# EAGLE design control_bdr (EAGLE 9.6.2)
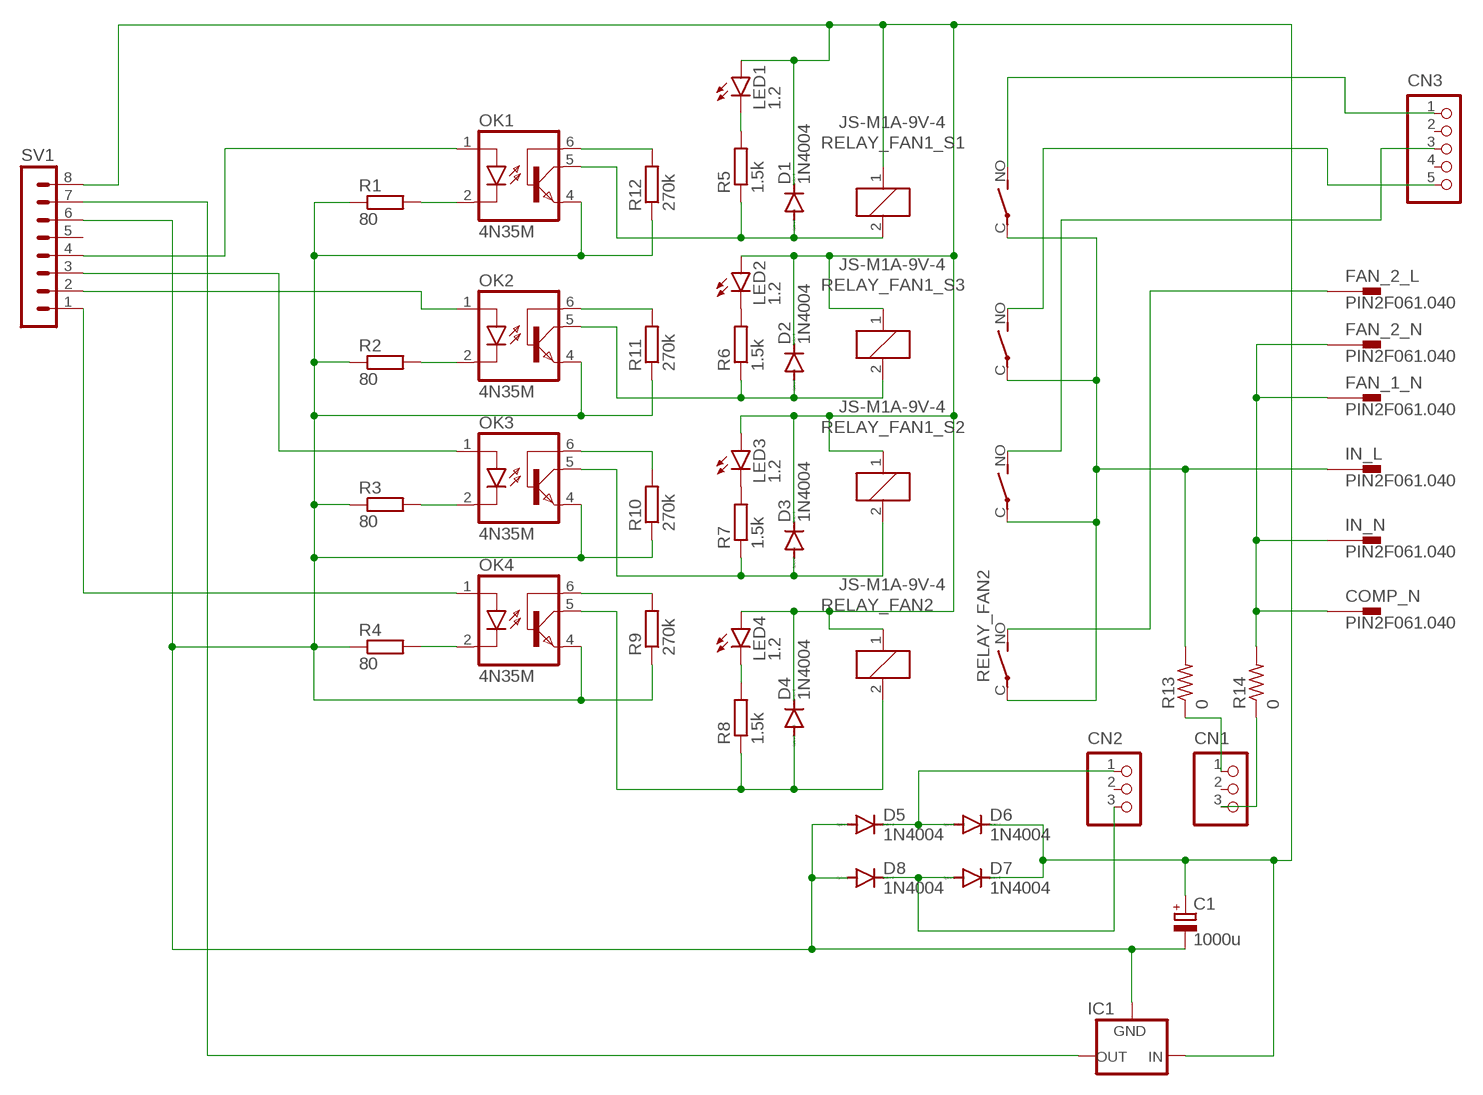
[diagram p0: schematic, sheet 1]

## Parts
C1  1000u  CPOL-EUE3.5-10  [E3,5-10]
CN1  B3P-VH  [B3P-VH]
CN2  B3B-XASK-1  [B3B-XASK-1]
CN3  B5P-VH  [B5P-VH]
COMP_N  PIN2F061.040  [F061.040]
D1  1N4004  [DO41-10]
D2  1N4004  [DO41-10]
D3  1N4004  [DO41-10]
D4  1N4004  [DO41-10]
D5  1N4004  [DO41-10]
D6  1N4004  [DO41-10]
D7  1N4004  [DO41-10]
D8  1N4004  [DO41-10]
FAN_1_N  PIN2F061.040  [F061.040]
FAN_2_L  PIN2F061.040  [F061.040]
FAN_2_N  PIN2F061.040  [F061.040]
IC1  78XXL  [78XXL]
IN_L  PIN2F061.040  [F061.040]
IN_N  PIN2F061.040  [F061.040]
LED1  1.2  LED5MM  [LED5MM]
LED2  1.2  LED5MM  [LED5MM]
LED3  1.2  LED5MM  [LED5MM]
LED4  1.2  LED5MM  [LED5MM]
OK1  4N35M  [DIL06]
OK2  4N35M  [DIL06]
OK3  4N35M  [DIL06]
OK4  4N35M  [DIL06]
R1  80  R-EU_0204/7  [0204/7]
R2  80  R-EU_0204/7  [0204/7]
R3  80  R-EU_0204/7  [0204/7]
R4  80  R-EU_0204/7  [0204/7]
R5  1.5k  R-EU_0204/7  [0204/7]
R6  1.5k  R-EU_0204/7  [0204/7]
R7  1.5k  R-EU_0204/7  [0204/7]
R8  1.5k  R-EU_0204/7  [0204/7]
R9  270k  R-EU_0204/7  [0204/7]
R10  270k  R-EU_0204/7  [0204/7]
R11  270k  R-EU_0204/7  [0204/7]
R12  270k  R-EU_0204/7  [0204/7]
R13  0  R-US_0204/2V  [0204V]
R14  0  R-US_0204/2V  [0204V]
RELAY_FAN1_S1  JS-M1A-9V-4  [JS-M1A]
RELAY_FAN1_S2  JS-M1A-9V-4  [JS-M1A]
RELAY_FAN1_S3  JS-M1A-9V-4  [JS-M1A]
RELAY_FAN2  JS-M1A-9V-4  [JS-M1A]
SV1  MA08-1  [MA08-1]

## Nets
N$1 [AC_IN_HIGH]: IN_L.A1 IN_L.A2 R13.2 RELAY_FAN1_S1.C(2:P) RELAY_FAN1_S2.C(2:P) RELAY_FAN1_S3.C(2:P) RELAY_FAN2.C(2:P)
N$2 [FAN_1_IN]: CN3.1 RELAY_FAN1_S1.NO(2:S)
N$3 [FAN_1_IN]: CN3.5 RELAY_FAN1_S3.NO(2:S)
N$4 [FAN_1_IN]: CN3.3 RELAY_FAN1_S2.NO(2:S)
N$5 [FAN_2_IN]: FAN_2_L.A1 FAN_2_L.A2 RELAY_FAN2.NO(2:S)
N$6 [AC_IN_HIGH]: COMP_N.A1 COMP_N.A2 FAN_1_N.A1 FAN_1_N.A2 FAN_2_N.A1 FAN_2_N.A2 IN_N.A1 IN_N.A2 R14.2
N$7 [dc_v]: OK1.2(C) R1.2
N$8 [dc_v]: OK2.2(C) R2.2
N$9 [dc_v]: OK3.2(C) R3.2
N$10 [dc_v]: OK4.2(C) R4.2
N$11 [gnd]: C1.- D5.A D8.A IC1.GND OK1.4(EMI) OK2.4(EMI) OK3.4(EMI) OK4.4(EMI) R1.1 R2.1 R3.1 R4.1 R9.1 R10.1 R11.1 R12.1 SV1.6
N$12 [dc_v]: LED2.K(C) R6.2
N$13 [dc_v]: LED1.K(C) R5.2
N$14 [dc_v]: LED3.K(C) R7.2
N$15 [dc_v]: LED4.K(C) R8.2
N$16 [AC_IN_LOW_CURR]: CN1.1 R13.1
N$17 [AC_IN_LOW_CURR]: CN1.3 R14.1
N$18 [dc_v]: OK4.6(BAS) R9.2
N$19 [dc_v]: OK3.6(BAS) R10.2
N$20 [dc_v]: OK2.6(BAS) R11.2
N$21 [dc_v]: OK1.6(BAS) R12.2
N$22 [dc_12v]: CN2.1 D5.C D6.A
N$23 [dc_v]: IC1.OUT SV1.7
N$24 [dc_12v]: CN2.3 D7.A D8.C
N$25 [dc_v]: OK2.1(A) SV1.2
N$26 [dc_v]: D4.A OK4.5(COL) R8.1 RELAY_FAN2.2
N$27 [dc_v]: D3.A OK3.5(COL) R7.1 RELAY_FAN1_S2.2
N$28 [dc_v]: D2.A OK2.5(COL) R6.1 RELAY_FAN1_S3.2
N$29 [dc_v]: D1.A OK1.5(COL) R5.1 RELAY_FAN1_S1.2
N$30 [dc_v]: OK1.1(A) SV1.4
N$32 [dc_v]: OK3.1(A) SV1.3
N$33 [dc_v]: OK4.1(A) SV1.1
N$34 [dc_12v]: C1.+ D1.C D2.C D3.C D4.C D6.C D7.C IC1.IN LED1.A LED2.A LED3.A LED4.A RELAY_FAN1_S1.1 RELAY_FAN1_S2.1 RELAY_FAN1_S3.1 RELAY_FAN2.1 SV1.8
Unconnected: CN1.2 CN2.2 CN3.2 CN3.4 SV1.5

## Library data of the parts
C1 = rcl:CPOL-EU: POLARIZED CAPACITOR, European symbol; SPICEPREFIX: C
CN1 = jst-vh:B3P-VH: Wire-to-Board 3.96mm pitch top mount connector Source: http://www.jst-mfg.com/product/pdf/jpn/VH.pdf http://www.jst-mfg.com/product/detail.php?series=262
CN2 = jst-xa:B3B-XASK-1: Wire-to-Board 2.5mm pitch top mount connector Source: http://www.jst-mfg.com/product/pdf/jpn/XA1.pdf http://www.jst-mfg.com/product/detail.php?series=272
CN3 = jst-vh:B5P-VH: Wire-to-Board 3.96mm pitch top mount connector Source: http://www.jst-mfg.com/product/pdf/jpn/VH.pdf http://www.jst-mfg.com/product/detail.php?series=262
COMP_N FAN_1_N FAN_2_L FAN_2_N IN_L IN_N = con-faston:PIN2: Flachstecker Typ Tyco/Electronics/AMP TAB, FASTON Printed Circuit Board Tabs Source: http://www.buerklin.com, http://catalog.tycoelectronics.com; OC_FARNELL: unknown; OC_NEWARK: unknown
D1-D8 = diode:1N4004: DIODE general purpose rectifier, 1 A
IC1 = v-reg:78XXL: VOLTAGE REGULATOR
LED1-LED4 = led:LED: LED OSRAM: - CHIPLED LG R971, LG N971, LY N971, LG Q971, LY Q971, LO R971, LY R971 LH N974, LH R974 LS Q976, LO Q976, LY Q976 LO Q996 - Hyper CHIPLED LW Q18S LB Q993, LB Q99A, LB R99A - SideLED LS A670, LO A670, LY A670, LG A670, LP A670 LB A673, LV A673, LT A673, LW A673 LH A674 LY A675 LS A676, LA A676, LO A676, LY A676, LW A676 LS A679, LY A679, LG A679 - Hyper Micro SIDELED® LS Y876, LA Y876, LO Y876, LY Y876 LT Y87S - SmartLED LW L88C, LW L88S LB L89C, LB L89S, LG L890 LS L89K, LO L89K, LY L89K LS L896, LA L896, LO L896, LY L896 - TOPLED LS T670, LO T670, LY T670, LG T670, LP T670 LSG T670, LSP T670, LSY T670, LOP T670, LYG T670 LG T671, LOG T671, LSG T671 LB T673, LV T673, LT T673, LW T673 LH T674 LS T676, LA T676, LO T676, LY T676, LB T676, LH T676, LSB T676, LW T676 LB T67C, LV T67C, LT T67C, LS T67K, LO T67K, LY T67K, LW E67C LS E67B, LA E67B, LO E67B, LY E67B, LB E67C, LV E67C, LT E67C LW T67C LS T679, LY T679, LG T679 LS T770, LO T770, LY T770, LG T770, LP T770 LB T773, LV T773, LT T773, LW T773 LH T774 LS E675, LA E675, LY E675, LS T675 LS T776, LA T776, LO T776, LY T776, LB T776 LHGB T686 LT T68C, LB T68C - Hyper Mini TOPLED® LB M676 - Mini TOPLED Santana® LG M470 LS M47K, LO M47K, LY M47K Source: http://www.osram.convergy.de LUXEON: - LUMILED® LXK2-PW12-R00, LXK2-PW12-S00, LXK2-PW14-U00, LXK2-PW14-V00 LXK2-PM12-R00, LXK2-PM12-S00, LXK2-PM14-U00 LXK2-PE12-Q00, LXK2-PE12-R00, LXK2-PE12-S00, LXK2-PE14-T00, LXK2-PE14-U00 LXK2-PB12-K00, LXK2-PB12-L00, LXK2-PB12-M00, LXK2-PB14-N00, LXK2-PB14-P00, LXK2-PB14-Q00 LXK2-PR12-L00, LXK2-PR12-M00, LXK2-PR14-Q00, LXK2-PR14-R00 LXK2-PD12-Q00, LXK2-PD12-R00, LXK2-PD12-S00 LXK2-PH12-R00, LXK2-PH12-S00 LXK2-PL12-P00, LXK2-PL12-Q00, LXK2-PL12-R00 Source: www.luxeon.com KINGBRIGHT: KA-3528ASYC Source: www.kingbright.com
OK1-OK4 = optocoupler:4N*?M: General Purpose 6-Pin Phototransistor Optocouplers Source: http://www.fairchildsemi.com/ds/4N/4N35-M.pdf; MPN: 4N35-M; OC_FARNELL: 1021351; OC_NEWARK: 98K9114
R1-R12 = rcl:R-EU_: RESISTOR, European symbol; SPICEPREFIX: R
R13 R14 = rcl:R-US_: RESISTOR, American symbol; SPICEPREFIX: R
RELAY_FAN1_S1-RELAY_FAN1_S3 RELAY_FAN2 = relay:JS-M1A*: Automotive Ultra-Miniature Power Relay NAiS Source: http://www.mew-europe.com/.. en_ds_61211_0000.pdf; OC_FARNELL: unknown; OC_NEWARK: unknown
SV1 = con-lstb:MA08-1: PIN HEADER; OC_FARNELL: unknown; OC_NEWARK: unknown

## Net classes
1 AC_IN_HIGH: width 10.16 mm, clearance 0.61 mm
2 FAN_1_IN: width 3.81 mm, clearance 0.61 mm
3 FAN_2_IN: width 5.08 mm, clearance 0.61 mm
4 AC_IN_LOW: width 7.62 mm, clearance 0.61 mm
5 dc_v: width 0.406 mm, clearance 0.051 mm
6 dc_12v: width 0.406 mm, clearance 0.051 mm
7 AC_IN_LOW_CURR: width 0.813 mm, clearance 0.61 mm
8 gnd: width 0.406 mm, clearance 0.051 mm

## Board
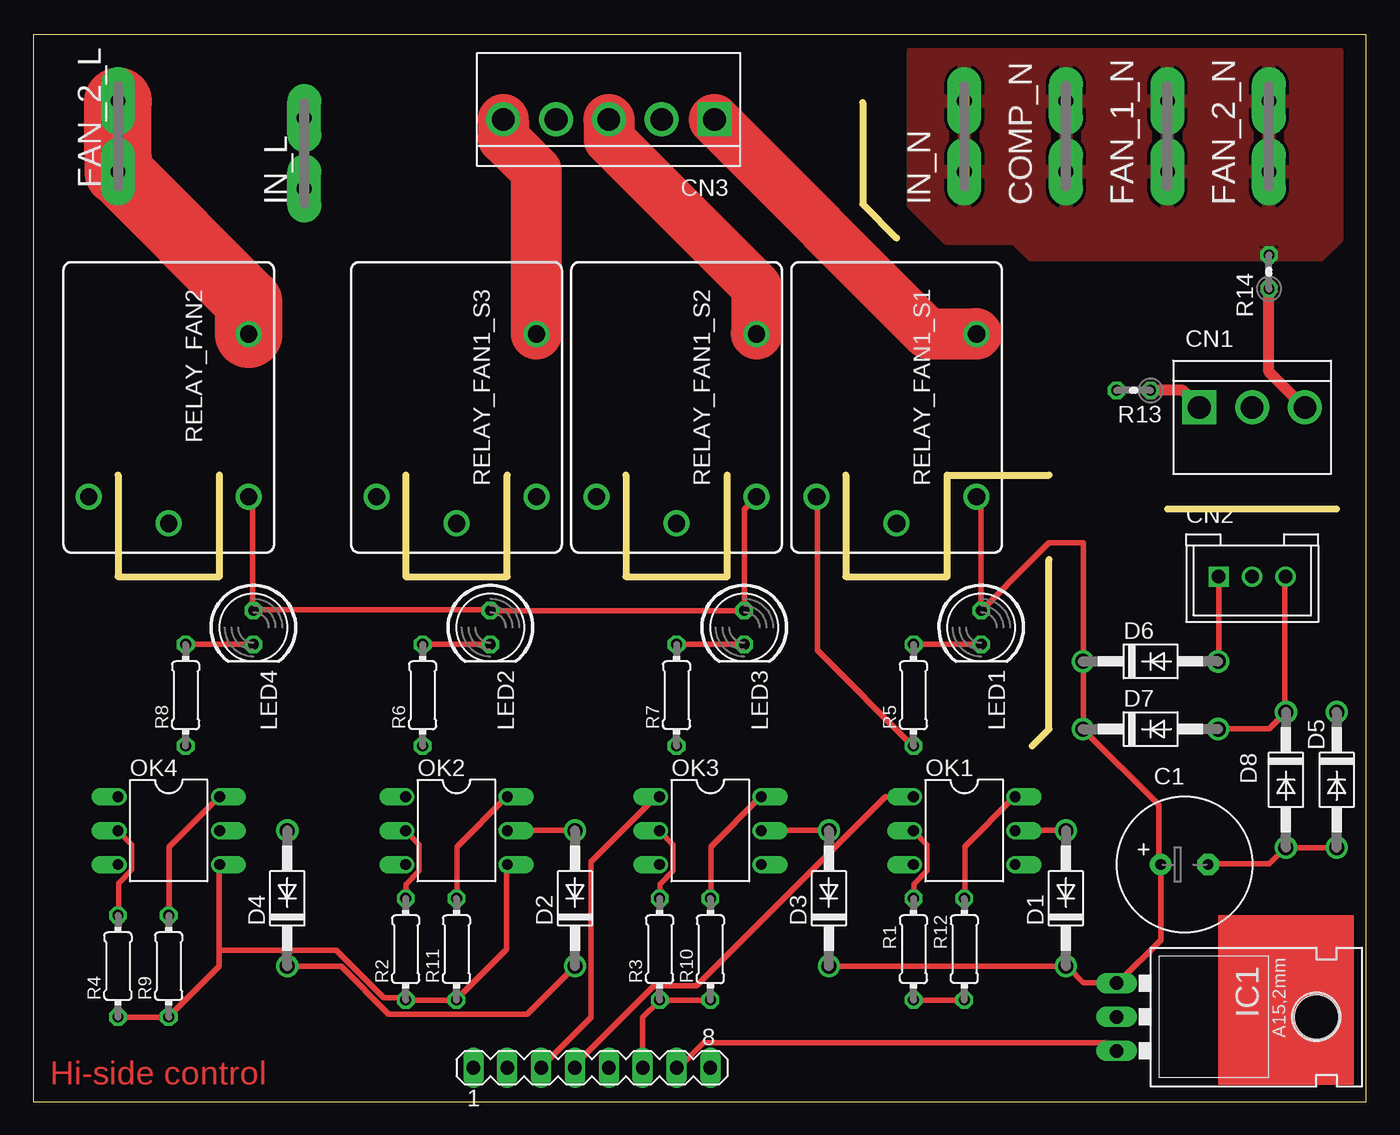
[diagram p1: board, top side]
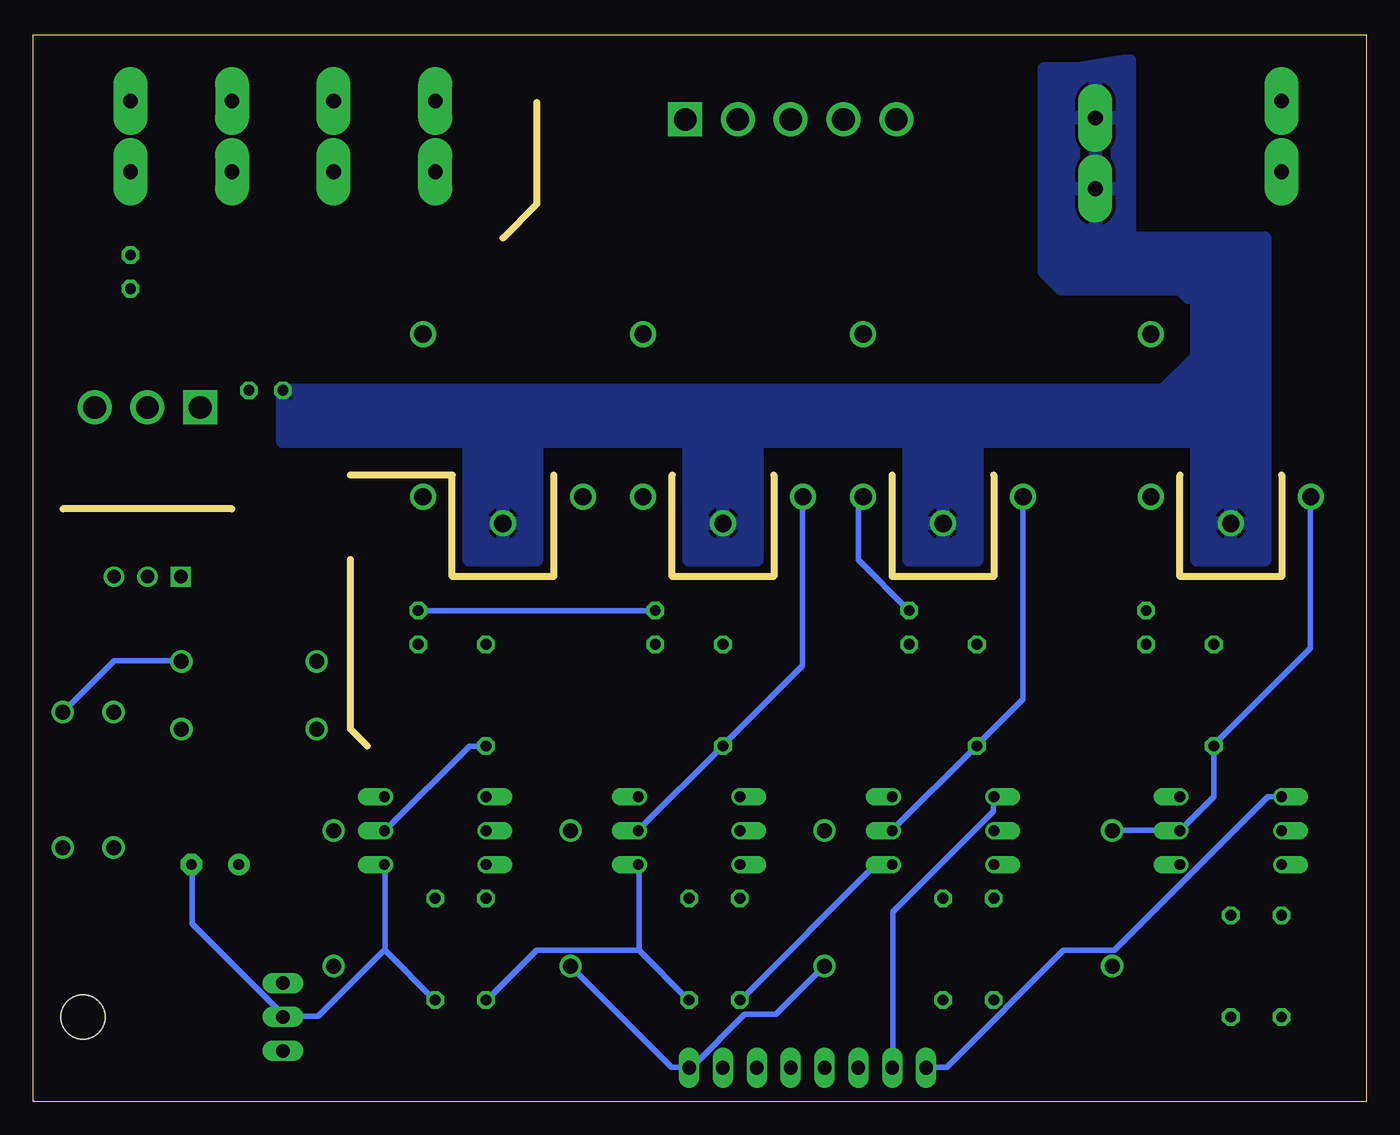
[diagram p2: board, bottom side, seen from below]

Size 100 x 80 mm. Coordinates in mm from the lower left corner, seen from the top.
Outline: 0,0 100,0 100,80 0,80 0,0
Copper layers (1*16): Top 0.035mm / dielectric 1.5mm / Bottom 0.035mm
Design rules "default": minimum track width 6mil, minimum drill 0.35mm, track to track 6mil, track to pad 6mil, pad to pad 6mil, via to via 6mil, smd to smd 6mil, copper to edge 40mil, drill to drill 6mil, minimum pad ring 10mil, minimum via ring 8mil, stop-mask expansion 4mil, vias tented up to drill 0mil, thermal gap 10mil
tRestrict: 18 lines
Milling: 18 lines

### Footprints (pad centres in the part's own frame; a part is rotated, then mirrored left to right if it is on the bottom)
E3,5-10 = drill 0.813 pad 1.6: + -1.778,0 | drill 0.813 pad 1.6 octagon: - 1.778,0
B3P-VH = drill 1.7 square: 1 -3.96,0 | drill 1.7: 2 0,0; 3 3.96,0
B3B-XASK-1 = drill 1.016 square: 1 -2.5,0 | drill 1.016: 2 0,0; 3 2.5,0
B5P-VH = drill 1.7 square: 1 -7.92,0 | drill 1.7: 2 -3.96,0; 3 0,0; 4 3.96,0; 5 7.92,0
F061.040 = drill 1.1 pad 2.54 long: A1 -2.65,0; A2 2.65,0
DO41-10 = drill 1.118: A 5.08,0; C -5.08,0
78XXL = drill 1.016 long: GND 0,-3.81; IN -2.54,-3.81; OUT 2.54,-3.81 | hole 3.302: 0,11.176
LED5MM = drill 0.813 octagon: A -1.27,0; K 1.27,0
DIL06 = drill 0.813 offset: 1 -2.54,-3.81; 2 0,-3.81; 3 2.54,-3.81; 4 2.54,3.81; 5 0,3.81; 6 -2.54,3.81
0204/7 = drill 0.813 octagon: 1 -3.81,0; 2 3.81,0
0204V = drill 0.813 octagon: 1 -1.27,0; 2 1.27,0
JS-M1A = drill 1.3: 1 6.7,6; 2 6.7,-6; C 8.7,0; NO -5.5,6
MA08-1 = drill 1.016 long: 1 -8.89,0; 2 -6.35,0; 3 -3.81,0; 4 -1.27,0; 5 1.27,0; 6 3.81,0; 7 6.35,0; 8 8.89,0

### Placement (x,y rotation side)
C1  86.36,17.78 0 top
CN1  91.44,52.07 0 top
CN2  91.44,39.37 0 top
CN3  43.18,73.66 180 top
COMP_N  77.47,72.39 90 top
D1  77.47,15.24 90 top
D2  40.64,15.24 90 top
D3  59.69,15.24 90 top
D4  19.05,15.24 90 top
D5  97.79,24.13 270 top
D6  83.82,33.02 0 top
D7  83.82,27.94 0 top
D8  93.98,24.13 270 top
FAN_1_N  85.09,72.39 270 top
FAN_2_L  6.35,72.39 90 top
FAN_2_N  92.71,72.39 90 top
IC1  85.09,6.35 270 top
IN_L  20.32,71.12 90 top
IN_N  69.85,72.39 90 top
LED1  71.12,35.56 270 top
LED2  34.29,35.56 270 top
LED3  53.34,35.56 270 top
LED4  16.51,35.56 270 top
OK1  69.85,20.32 270 top
OK2  31.75,20.32 270 top
OK3  50.8,20.32 270 top
OK4  10.16,20.32 270 top
R1  66.04,11.43 90 top
R2  27.94,11.43 90 top
R3  46.99,11.43 90 top
R4  6.35,10.16 90 top
R5  66.04,30.48 90 top
R6  29.21,30.48 90 top
R7  48.26,30.48 90 top
R8  11.43,30.48 90 top
R9  10.16,10.16 90 top
R10  50.8,11.43 90 top
R11  31.75,11.43 90 top
R12  69.85,11.43 90 top
R13  82.55,53.34 180 top
R14  92.71,62.23 90 top
RELAY_FAN1_S1  64.77,52.07 270 top
RELAY_FAN1_S2  48.26,52.07 270 top
RELAY_FAN1_S3  31.75,52.07 270 top
RELAY_FAN2  10.16,52.07 270 top
SV1  41.91,2.54 0 top

### Tracks (layer width: path | path; a pad name or v marks a point on that pad's centre or on a via)
N$1
  pour Bottom: 17.78,78.11 17.78,64.77 7.62,64.77 7.62,40.64 12.7,40.64 12.7,49.53 29.21,49.53 29.21,40.64 34.29,40.64 34.29,49.53 45.72,49.53 45.72,40.64 50.8,40.64 50.8,49.53 62.23,49.53 62.23,40.64 67.31,40.64 67.31,49.53 81.28,49.53 81.28,53.34 15.24,53.34 12.7,55.88 12.7,60.33 13.34,60.33 13.97,60.96 22.86,60.96 24.13,62.23 24.13,77.47 21.59,77.47
N$2
  Top 3.81: RELAY_FAN1_S1.NO 70.71,57.61 67.13,57.61 51.13,73.61 CN3.1
N$3
  Top 3.81: RELAY_FAN1_S3.NO 37.72,57.61 37.72,69.8 35.28,72.24 35.28,73.61 CN3.5
N$4
  Top 3.81: RELAY_FAN1_S2.NO 54.25,57.61 54.25,61.11 43.2,72.16 43.2,73.61 CN3.3
N$5
  Top 5.08: RELAY_FAN2.NO 16.15,57.61 16.15,59.97 6.4,69.72 FAN_2_L.A1 6.33,72.24 6.33,74.98 FAN_2_L.A2
N$6
  pour Top: 66.04,78.74 66.04,67.31 68.58,64.77 73.66,64.77 74.93,63.5 96.52,63.5 97.79,64.77 97.79,78.74
N$7
  Top 0.406: R1.2 66.06,15.24 66.06,16.31 67.06,17.3 67.06,19.28 66.06,20.27 OK1.2
N$8
  Top 0.406: R2.2 27.96,15.24 27.96,16.31 28.96,17.3 28.96,19.28 27.96,20.27 OK2.2
N$9
  Top 0.406: R3.2 47.02,15.24 47.02,16.31 48.01,17.3 48.01,19.28 47.02,20.27 OK3.2
N$10
  Top 0.406: OK4.2 7.39,19.28 7.39,17.37 6.4,16.38 6.4,14.02 R4.2
N$11
  Top 0.406: OK2.4 35.51,17.75 35.51,11.43 31.85,7.77 R11.1 R2.1 27.81,7.77 26.29,7.77 22.71,11.35 13.95,11.35 | R4.1 6.4,6.33 10.13,6.33 R9.1 13.95,10.13 13.95,11.35 | 13.95,11.35 13.95,17.75 OK4.4 | R10.1 R3.1 46.86,7.47 45.72,6.33 SV1.6 | R12.1 R1.1 | C1.- 88.16,17.83 92.73,17.83 93.95,19.05 D8.A D5.A
  Bottom 0.406: 54.56,11.35 54.56,17.75 OK3.4 | 54.56,11.35 50.83,7.62 R10.1 | 73.61,11.35 73.61,17.75 OK1.4 | 73.61,11.35 69.88,7.62 R12.1 | 54.56,11.35 62.26,11.35 65.99,7.62 R1.1 | OK2.4 35.59,17.75 36.8,17.75 46.94,7.62 R3.1 | 73.61,11.35 73.76,11.28 78.64,6.4 81.23,6.4 IC1.GND 81.31,6.55 88.09,13.34 88.09,17.75 C1.-
N$12
  Top 0.406: LED2.K R6.2
N$13
  Top 0.406: LED1.K R5.2
N$14
  Top 0.406: LED3.K R7.2
N$15
  Top 0.406: LED4.K R8.2
N$16
  Top 0.813: R13.1 86.26,53.34 87.48,52.12 CN1.1
N$17
  Top 0.813: R14.1 92.71,54.74 95.33,52.12 CN1.3
N$18
  Top 0.406: R9.2 10.21,14.02 10.21,19.13 13.95,22.86 OK4.6
N$19
  Top 0.406: R10.2 50.83,15.24 50.83,19.13 54.56,22.86 OK3.6
N$20
  Top 0.406: R11.2 31.77,15.24 31.77,19.13 35.51,22.86 OK2.6
N$21
  Top 0.406: R12.2 69.88,15.24 69.88,19.13 73.61,22.86 OK1.6
N$22
  Top 0.406: CN2.1 88.92,39.32 88.92,33.07 D6.A
  Bottom 0.406: D5.C 93.93,33.07 88.92,33.07 D6.A
N$23
  Top 0.406: SV1.7 48.31,2.59 48.46,2.59 50.29,4.42 80.62,4.42 81.23,3.81 IC1.OUT
N$24
  Top 0.406: CN2.3 93.88,39.32 93.88,29.34 D8.C 92.73,27.96 88.92,27.96 D7.A
N$25
  Bottom 0.406: OK2.1 27.96,22.86 27.96,21.79 35.51,14.25 35.51,2.59 SV1.2
N$26
  Bottom 0.406: D4.A 19.05,20.34 14.1,20.34 OK4.5 11.43,22.86 R8.1 11.35,26.82 4.19,33.98 4.19,45.34 RELAY_FAN2.2
N$27
  Top 0.406: OK3.5 54.63,20.34 59.66,20.34 D3.A
  Bottom 0.406: OK3.5 54.63,20.34 48.31,26.67 R7.1 48.16,26.82 42.29,32.69 42.29,45.34 RELAY_FAN1_S2.2
N$28
  Top 0.406: OK2.5 35.59,20.34 40.62,20.34 D2.A
  Bottom 0.406: OK2.5 35.59,20.34 29.26,26.67 R6.1 29.11,26.82 25.76,30.18 25.76,45.34 RELAY_FAN1_S3.2
N$29
  Top 0.406: OK1.5 73.69,20.34 77.42,20.34 D1.A | RELAY_FAN1_S1.2 58.83,45.34 58.83,33.83 65.99,26.67 R5.1
  Bottom 0.406: R5.1 67.28,26.67 73.61,20.34 OK1.5
N$30
  Top 0.406: OK1.1 63.93,22.86 49.76,8.69 46.56,8.69 40.69,2.82 40.69,2.59 SV1.4
N$32
  Top 0.406: OK3.1 46.71,22.86 41.83,17.98 41.83,6.33 38.1,2.59 SV1.3
N$33
  Bottom 0.406: OK4.1 7.39,22.86 18.9,11.35 22.71,11.35 31.47,2.59 32.99,2.59 SV1.1
N$34
  Top 0.406: D2.C 37.03,6.55 26.67,6.55 23.09,10.13 19.05,10.13 D4.C | RELAY_FAN2.1 16.23,45.34 16.46,45.11 16.46,36.88 LED4.A 16.69,36.88 34.29,36.88 LED2.A LED3.A 53.34,44.42 54.25,45.34 RELAY_FAN1_S2.1 | 78.79,32.99 78.79,27.96 D7.C 84.43,22.25 84.43,17.91 C1.+ 84.58,12.12 81.46,8.99 IC1.IN 81.23,8.91 78.79,8.91 77.65,10.06 D1.C 77.27,10.13 59.74,10.13 D3.C | 78.79,32.99 D6.C | RELAY_FAN1_S1.1 70.79,45.34 71.09,45.03 71.09,36.88 LED1.A 74.93,40.64 76.2,41.91 78.74,41.91 78.79,41.86 78.79,32.99
  Bottom 0.406: D3.C 52.12,2.59 50.83,2.59 SV1.8 50.67,2.67 50.52,2.67 46.63,6.55 44.27,6.55 40.69,10.13 D2.C | RELAY_FAN1_S3.1 38.1,45.02 38.1,40.64 LED2.A | LED3.A 53.34,36.8 70.94,36.8 LED1.A
(copper drawn outside any net)
  shapes: Top area x1

### Text on the board
Top: Hi-side control